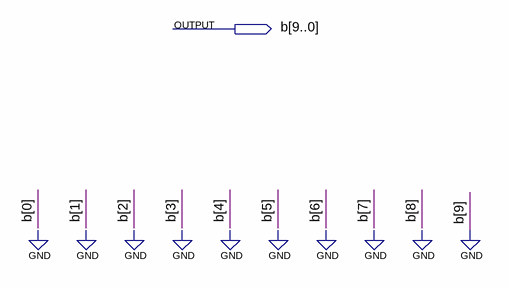
[diagram p0: schematic sheet]
// Quartus schematic gnd10.bdf as structural Verilog: 0 symbols, 1 pins
module gnd10 (
  output [9:0] b
);


  assign b[9] = 1'b0;
endmodule
